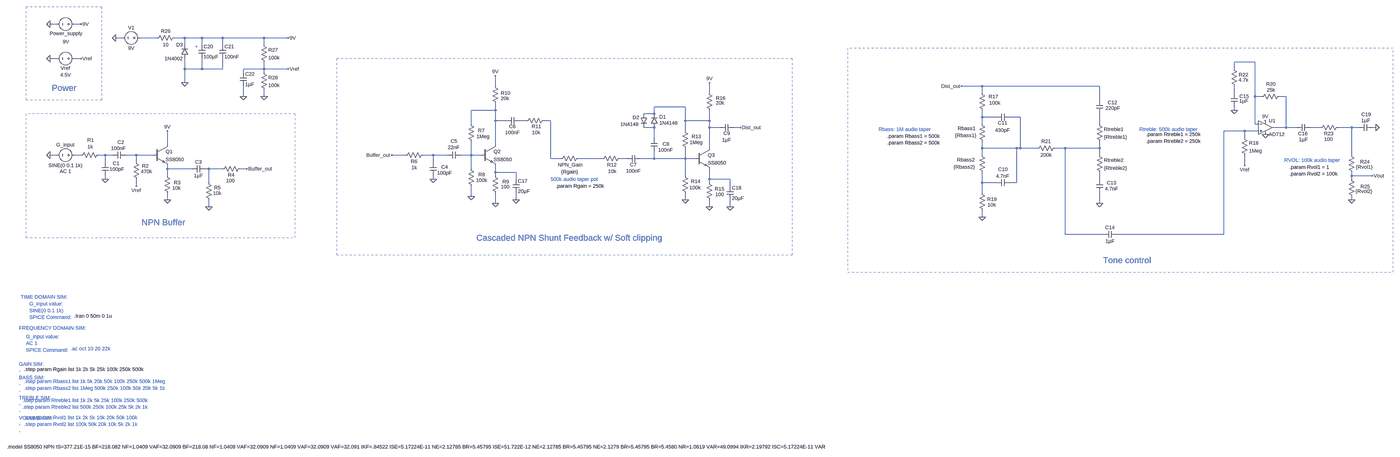
[diagram p0: schematic fuzz_pedal_PowerSup.asc, whole sheet]
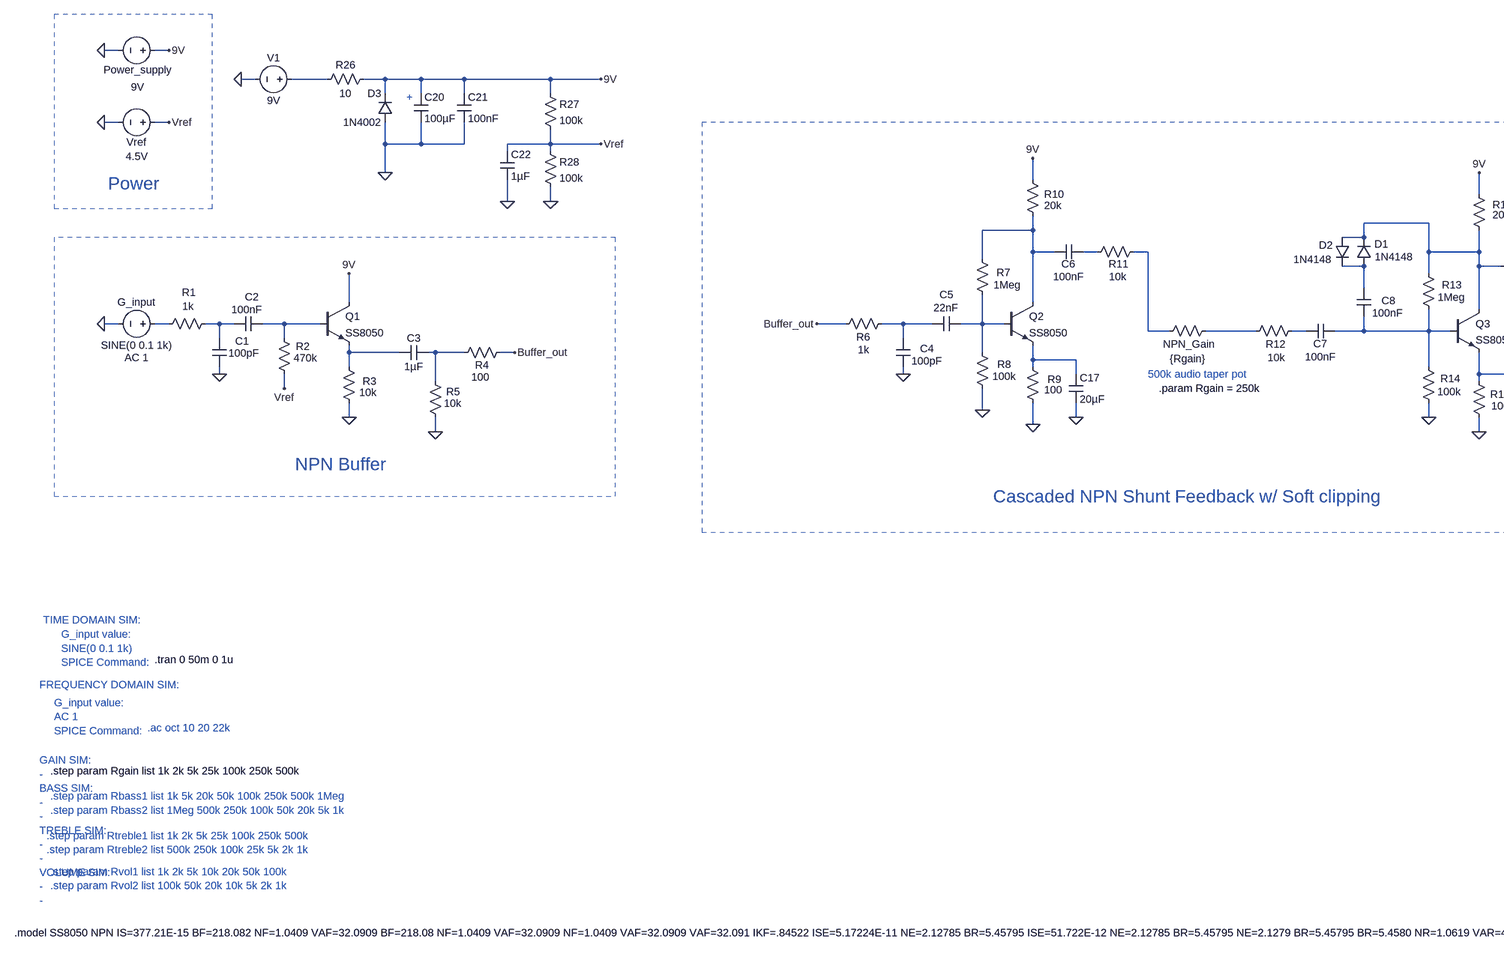
[diagram p1: schematic fuzz_pedal_PowerSup.asc, part, row 1 of 1, column 1 of 2]
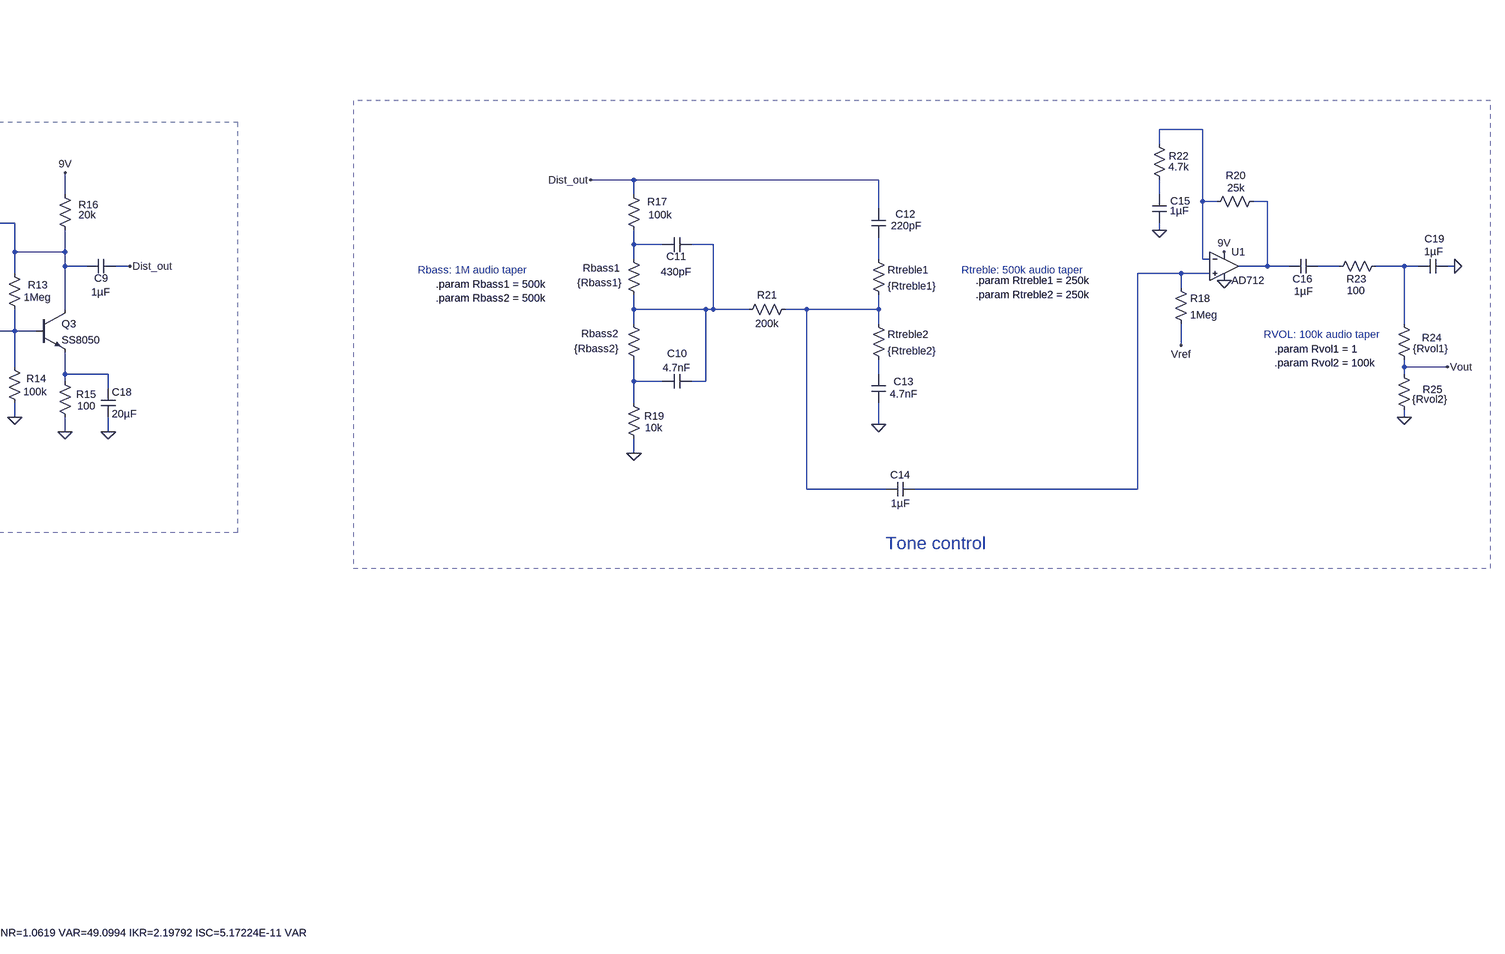
[diagram p2: schematic fuzz_pedal_PowerSup.asc, part, row 1 of 1, column 2 of 2]
fuzz_pedal_PowerSup.asc, the LTspice schematic file:
Version 4
SHEET 1 12484 1584
WIRE 176 -528 144 -528
WIRE 288 -528 256 -528
WIRE 480 -464 448 -464
WIRE 640 -464 560 -464
WIRE 768 -464 720 -464
WIRE 848 -464 768 -464
WIRE 944 -464 848 -464
WIRE 1136 -464 944 -464
WIRE 1248 -464 1136 -464
WIRE 768 -432 768 -464
WIRE 848 -432 848 -464
WIRE 944 -432 944 -464
WIRE 1136 -432 1136 -464
WIRE 176 -368 144 -368
WIRE 288 -368 256 -368
WIRE 5840 -352 5744 -352
WIRE 768 -320 768 -368
WIRE 848 -320 848 -368
WIRE 848 -320 768 -320
WIRE 944 -320 944 -368
WIRE 944 -320 848 -320
WIRE 1136 -320 1136 -352
WIRE 1136 -320 1040 -320
WIRE 1248 -320 1136 -320
WIRE 5744 -320 5744 -352
WIRE 1040 -304 1040 -320
WIRE 1136 -304 1136 -320
WIRE 768 -256 768 -320
WIRE 2208 -240 2208 -288
WIRE 4576 -240 4480 -240
WIRE 5120 -240 4576 -240
WIRE 3200 -208 3200 -256
WIRE 4576 -208 4576 -240
WIRE 5744 -208 5744 -240
WIRE 1040 -192 1040 -240
WIRE 1136 -192 1136 -224
WIRE 5840 -192 5840 -352
WIRE 5872 -192 5840 -192
WIRE 5984 -192 5952 -192
WIRE 5120 -176 5120 -240
WIRE 3088 -144 2944 -144
WIRE 2208 -128 2208 -160
WIRE 2208 -128 2096 -128
WIRE 5744 -128 5744 -144
WIRE 2944 -112 2944 -144
WIRE 2944 -112 2896 -112
WIRE 4576 -96 4576 -128
WIRE 4640 -96 4576 -96
WIRE 4752 -96 4704 -96
WIRE 2208 -80 2208 -128
WIRE 2256 -80 2208 -80
WIRE 2352 -80 2320 -80
WIRE 2464 -80 2432 -80
WIRE 3088 -80 3088 -144
WIRE 3200 -80 3200 -128
WIRE 3200 -80 3088 -80
WIRE 2096 -64 2096 -128
WIRE 4576 -64 4576 -96
WIRE 5120 -64 5120 -112
WIRE 5840 -64 5840 -192
WIRE 5856 -64 5840 -64
WIRE 2944 -48 2896 -48
WIRE 3200 -48 3200 -80
WIRE 3248 -48 3200 -48
WIRE 3344 -48 3312 -48
WIRE 5984 -48 5984 -192
WIRE 5984 -48 5920 -48
WIRE 6032 -48 5984 -48
WIRE 6144 -48 6096 -48
WIRE 6288 -48 6224 -48
WIRE 6320 -48 6288 -48
WIRE 6400 -48 6384 -48
WIRE 3088 -32 3088 -80
WIRE 5792 -32 5696 -32
WIRE 5856 -32 5792 -32
WIRE 2944 0 2944 -48
WIRE 5792 0 5792 -32
WIRE 688 32 688 -32
WIRE 2208 32 2208 -80
WIRE 3200 48 3200 -48
WIRE 4576 48 4576 16
WIRE 4736 48 4576 48
WIRE 4752 48 4752 -96
WIRE 4752 48 4736 48
WIRE 4832 48 4752 48
WIRE 4960 48 4912 48
WIRE 5120 48 5120 16
WIRE 5120 48 4960 48
WIRE 176 80 144 80
WIRE 288 80 256 80
WIRE 400 80 368 80
WIRE 432 80 400 80
WIRE 544 80 496 80
WIRE 624 80 544 80
WIRE 1792 80 1728 80
WIRE 1920 80 1872 80
WIRE 1984 80 1920 80
WIRE 2096 80 2096 16
WIRE 2096 80 2048 80
WIRE 2144 80 2096 80
WIRE 4576 80 4576 48
WIRE 5120 80 5120 48
WIRE 6288 80 6288 -48
WIRE 2464 96 2464 -80
WIRE 2512 96 2464 96
WIRE 2704 96 2592 96
WIRE 2816 96 2784 96
WIRE 2944 96 2944 64
WIRE 2944 96 2880 96
WIRE 3088 96 3088 48
WIRE 3088 96 2944 96
WIRE 3136 96 3088 96
WIRE 400 112 400 80
WIRE 544 112 544 80
WIRE 1920 112 1920 80
WIRE 5792 128 5792 80
WIRE 688 144 688 128
WIRE 800 144 688 144
WIRE 880 144 864 144
WIRE 944 144 880 144
WIRE 1056 144 1024 144
WIRE 2096 144 2096 80
WIRE 2208 160 2208 128
WIRE 2304 160 2208 160
WIRE 688 176 688 144
WIRE 2208 176 2208 160
WIRE 3088 176 3088 96
WIRE 6288 176 6288 160
WIRE 6384 176 6288 176
WIRE 400 192 400 176
WIRE 1920 192 1920 176
WIRE 2304 192 2304 160
WIRE 3200 192 3200 144
WIRE 3296 192 3200 192
WIRE 5120 192 5120 160
WIRE 6288 192 6288 176
WIRE 880 208 880 144
WIRE 3200 208 3200 192
WIRE 4576 208 4576 160
WIRE 4640 208 4576 208
WIRE 4736 208 4736 48
WIRE 4736 208 4704 208
WIRE 544 224 544 192
WIRE 3296 224 3296 192
WIRE 4576 256 4576 208
WIRE 2096 272 2096 224
WIRE 688 288 688 256
WIRE 2304 288 2304 256
WIRE 3088 288 3088 256
WIRE 6288 288 6288 272
WIRE 2208 304 2208 256
WIRE 5120 304 5120 256
WIRE 880 320 880 288
WIRE 3200 320 3200 288
WIRE 3296 320 3296 288
WIRE 4576 368 4576 336
WIRE 4960 448 4960 48
WIRE 5136 448 4960 448
WIRE 5696 448 5696 -32
WIRE 5696 448 5200 448
FLAG 400 192 0
FLAG 144 -528 0
FLAG 288 -528 9V
FLAG 688 -32 9V
FLAG 144 -368 0
FLAG 288 -368 Vref
FLAG 544 224 Vref
FLAG 688 288 0
FLAG 880 320 0
FLAG 1056 144 Buffer_out
FLAG 1728 80 Buffer_out
FLAG 1920 192 0
FLAG 2096 272 0
FLAG 2208 304 0
FLAG 2208 -288 9V
FLAG 3088 288 0
FLAG 3200 320 0
FLAG 3200 -256 9V
FLAG 144 80 0
FLAG 3344 -48 Dist_out
FLAG 4480 -240 Dist_out
FLAG 4576 368 0
FLAG 5120 304 0
FLAG 5792 128 Vref
FLAG 5888 -16 0
FLAG 5888 -80 9V
FLAG 5744 -128 0
FLAG 6384 176 Vout
FLAG 6288 288 0
FLAG 2304 288 0
FLAG 3296 320 0
FLAG 6400 -48 0
FLAG 768 -256 0
FLAG 1040 -192 0
FLAG 1136 -192 0
FLAG 1248 -464 9V
FLAG 1248 -320 Vref
FLAG 448 -464 0
SYMBOL voltage 272 80 R90
WINDOW 0 -32 56 VBottom 2
WINDOW 3 32 56 VTop 2
WINDOW 123 60 56 VTop 2
WINDOW 39 0 0 Left 0
SYMATTR InstName G_input
SYMATTR Value SINE(0 0.1 1k)
SYMATTR Value2 AC 1
SYMBOL res 384 64 R90
WINDOW 0 -38 52 VBottom 2
WINDOW 3 -38 54 VTop 2
SYMATTR InstName R1
SYMATTR Value 1k
SYMBOL cap 384 112 R0
WINDOW 0 51 7 Left 2
WINDOW 3 36 33 Left 2
SYMATTR InstName C1
SYMATTR Value 100pF
SYMBOL cap 496 64 R90
WINDOW 0 -28 24 VBottom 2
WINDOW 3 -31 35 VTop 2
SYMATTR InstName C2
SYMATTR Value 100nF
SYMBOL res 528 96 R0
WINDOW 0 42 34 Left 2
WINDOW 3 37 60 Left 2
SYMATTR InstName R2
SYMATTR Value 470k
SYMBOL npn 624 32 R0
SYMATTR InstName Q1
SYMATTR Value SS8050
SYMBOL voltage 272 -528 R90
WINDOW 0 59 54 VBottom 2
WINDOW 3 66 54 VTop 2
SYMATTR InstName Power_supply
SYMATTR Value 9V
SYMBOL voltage 272 -368 R90
WINDOW 0 60 57 VBottom 2
WINDOW 3 60 56 VTop 2
SYMATTR InstName Vref
SYMATTR Value 4.5V
SYMBOL res 672 160 R0
WINDOW 0 46 48 Left 2
WINDOW 3 39 73 Left 2
SYMATTR InstName R3
SYMATTR Value 10k
SYMBOL res 1040 128 R90
WINDOW 0 60 56 VBottom 2
WINDOW 3 55 60 VTop 2
SYMATTR InstName R4
SYMATTR Value 100
SYMBOL res 864 192 R0
WINDOW 0 40 39 Left 2
WINDOW 3 35 65 Left 2
SYMATTR InstName R5
SYMATTR Value 10k
SYMBOL res 1888 64 R90
WINDOW 0 61 57 VBottom 2
WINDOW 3 58 56 VTop 2
SYMATTR InstName R6
SYMATTR Value 1k
SYMBOL cap 1904 112 R0
WINDOW 0 53 23 Left 2
WINDOW 3 34 51 Left 2
SYMATTR InstName C4
SYMATTR Value 100pF
SYMBOL cap 2048 64 R90
WINDOW 0 -33 32 VBottom 2
WINDOW 3 -35 33 VTop 2
SYMATTR InstName C5
SYMATTR Value 22nF
SYMBOL res 2080 -80 R0
WINDOW 0 47 46 Left 2
WINDOW 3 41 74 Left 2
SYMATTR InstName R7
SYMATTR Value 1Meg
SYMBOL res 2080 128 R0
WINDOW 0 49 42 Left 2
WINDOW 3 38 69 Left 2
SYMATTR InstName R8
SYMATTR Value 100k
SYMBOL npn 2144 32 R0
SYMATTR InstName Q2
SYMATTR Value SS8050
SYMBOL res 2192 160 R0
WINDOW 0 49 44 Left 2
WINDOW 3 41 67 Left 2
SYMATTR InstName R9
SYMATTR Value 100
SYMBOL res 2192 -256 R0
WINDOW 0 41 48 Left 2
WINDOW 3 41 73 Left 2
SYMATTR InstName R10
SYMATTR Value 20k
SYMBOL cap 2320 -96 R90
WINDOW 0 59 33 VBottom 2
WINDOW 3 56 32 VTop 2
SYMATTR InstName C6
SYMATTR Value 100nF
SYMBOL res 2448 -96 R90
WINDOW 0 59 49 VBottom 2
WINDOW 3 56 51 VTop 2
SYMATTR InstName R11
SYMATTR Value 10k
SYMBOL res 2608 80 R90
WINDOW 0 61 53 VBottom 2
WINDOW 3 62 56 VTop 2
SYMATTR InstName NPN_Gain
SYMATTR Value {Rgain}
SYMBOL res 2800 80 R90
WINDOW 0 61 52 VBottom 2
WINDOW 3 60 51 VTop 2
SYMATTR InstName R12
SYMATTR Value 10k
SYMBOL cap 2880 80 R90
WINDOW 0 60 33 VBottom 2
WINDOW 3 58 32 VTop 2
SYMATTR InstName C7
SYMATTR Value 100nF
SYMBOL npn 3136 48 R0
SYMATTR InstName Q3
SYMATTR Value SS8050
SYMBOL cap 2928 0 R0
WINDOW 0 55 29 Left 2
WINDOW 3 34 56 Left 2
SYMATTR InstName C8
SYMATTR Value 100nF
SYMBOL res 3072 -48 R0
WINDOW 0 45 42 Left 2
WINDOW 3 36 69 Left 2
SYMATTR InstName R13
SYMATTR Value 1Meg
SYMBOL res 3072 160 R0
WINDOW 0 42 42 Left 2
WINDOW 3 35 71 Left 2
SYMATTR InstName R14
SYMATTR Value 100k
SYMBOL res 3184 192 R0
WINDOW 0 41 45 Left 2
WINDOW 3 43 71 Left 2
SYMATTR InstName R15
SYMATTR Value 100
SYMBOL diode 2960 -48 R180
WINDOW 0 -38 49 Left 2
WINDOW 3 -93 21 Left 2
SYMATTR InstName D1
SYMATTR Value 1N4148
SYMBOL diode 2880 -112 R0
WINDOW 0 -36 17 Left 2
WINDOW 3 -93 49 Left 2
SYMATTR InstName D2
SYMATTR Value 1N4148
SYMBOL res 3184 -224 R0
WINDOW 0 46 39 Left 2
WINDOW 3 46 62 Left 2
SYMATTR InstName R16
SYMATTR Value 20k
SYMBOL cap 3312 -64 R90
WINDOW 0 58 32 VBottom 2
WINDOW 3 58 33 VTop 2
SYMATTR InstName C9
SYMATTR Value 1µF
SYMBOL cap 864 128 R90
WINDOW 0 0 32 VBottom 2
WINDOW 3 32 32 VTop 2
SYMATTR InstName C3
SYMATTR Value 1µF
SYMBOL res 4560 -224 R0
WINDOW 0 46 33 Left 2
WINDOW 3 48 62 Left 2
SYMATTR InstName R17
SYMATTR Value 100k
SYMBOL res 4560 240 R0
WINDOW 0 39 45 Left 2
WINDOW 3 41 71 Left 2
SYMATTR InstName R19
SYMATTR Value 10k
SYMBOL cap 4704 192 R90
WINDOW 0 -30 32 VBottom 2
WINDOW 3 -30 33 VTop 2
SYMATTR InstName C10
SYMATTR Value 4.7nF
SYMBOL cap 4704 -112 R90
WINDOW 0 58 34 VBottom 2
WINDOW 3 61 34 VTop 2
SYMATTR InstName C11
SYMATTR Value 430pF
SYMBOL res 4560 -80 R0
WINDOW 0 -98 36 Left 2
WINDOW 3 -110 69 Left 2
SYMATTR InstName Rbass1
SYMATTR Value {Rbass1}
SYMBOL res 4560 64 R0
WINDOW 0 -101 38 Left 2
WINDOW 3 -117 71 Left 2
SYMATTR InstName Rbass2
SYMATTR Value {Rbass2}
SYMBOL res 4928 32 R90
WINDOW 0 0 56 VBottom 2
WINDOW 3 32 56 VTop 2
SYMATTR InstName R21
SYMATTR Value 200k
SYMBOL res 5104 -80 R0
SYMATTR InstName Rtreble1
SYMATTR Value {Rtreble1}
SYMBOL res 5104 64 R0
SYMATTR InstName Rtreble2
SYMATTR Value {Rtreble2}
SYMBOL cap 5104 -176 R0
WINDOW 0 53 12 Left 2
WINDOW 3 43 38 Left 2
SYMATTR InstName C12
SYMATTR Value 220pF
SYMBOL cap 5104 192 R0
WINDOW 0 49 17 Left 2
WINDOW 3 41 44 Left 2
SYMATTR InstName C13
SYMATTR Value 4.7nF
SYMBOL cap 5200 432 R90
WINDOW 0 0 32 VBottom 2
WINDOW 3 32 32 VTop 2
SYMATTR InstName C14
SYMATTR Value 1µF
SYMBOL res 5776 -16 R0
SYMATTR InstName R18
SYMATTR Value 1Meg
SYMBOL OpAmps\\AD712 5888 -112 R0
SYMATTR InstName U1
SYMBOL res 5968 -208 R90
WINDOW 0 -26 54 VBottom 2
WINDOW 3 -30 54 VTop 2
SYMATTR InstName R20
SYMATTR Value 25k
SYMBOL res 5728 -336 R0
WINDOW 0 37 43 Left 2
WINDOW 3 36 67 Left 2
SYMATTR InstName R22
SYMATTR Value 4.7k
SYMBOL cap 5728 -208 R0
WINDOW 0 40 15 Left 2
WINDOW 3 39 37 Left 2
SYMATTR InstName C15
SYMATTR Value 1µF
SYMBOL cap 6096 -64 R90
WINDOW 0 60 34 VBottom 2
WINDOW 3 56 32 VTop 2
SYMATTR InstName C16
SYMATTR Value 1µF
SYMBOL res 6240 -64 R90
WINDOW 0 60 58 VBottom 2
WINDOW 3 55 59 VTop 2
SYMATTR InstName R23
SYMATTR Value 100
SYMBOL res 6272 64 R0
WINDOW 0 55 47 Left 2
WINDOW 3 35 71 Left 2
SYMATTR InstName R24
SYMATTR Value {Rvol1}
SYMBOL res 6272 176 R0
WINDOW 0 57 50 Left 2
WINDOW 3 34 72 Left 2
SYMATTR InstName R25
SYMATTR Value {Rvol2}
SYMBOL cap 2288 192 R0
SYMATTR InstName C17
SYMATTR Value 20µF
SYMBOL cap 3280 224 R0
SYMATTR InstName C18
SYMATTR Value 20µF
SYMBOL cap 6384 -64 R90
WINDOW 0 -29 29 VBottom 2
WINDOW 3 -32 31 VTop 2
SYMATTR InstName C19
SYMATTR Value 1µF
SYMBOL res 736 -480 R90
WINDOW 0 0 56 VBottom 2
WINDOW 3 32 56 VTop 2
SYMATTR InstName R26
SYMATTR Value 10
SYMBOL diode 784 -368 R180
WINDOW 0 24 64 Left 2
WINDOW 3 24 0 Left 2
SYMATTR InstName D3
SYMATTR Value 1N4002
SYMBOL cap 928 -432 R0
SYMATTR InstName C21
SYMATTR Value 100nF
SYMBOL cap 832 -432 R0
SYMATTR InstName C20
SYMATTR Value 100µF
SYMBOL res 1120 -448 R0
SYMATTR InstName R27
SYMATTR Value 100k
SYMBOL res 1120 -320 R0
SYMATTR InstName R28
SYMATTR Value 100k
SYMBOL cap 1024 -304 R0
SYMATTR InstName C22
SYMATTR Value 1µF
SYMBOL voltage 576 -464 R90
WINDOW 0 -32 56 VBottom 2
WINDOW 3 32 56 VTop 2
SYMATTR InstName V1
SYMATTR Value 9V
TEXT 568 392 Left 4 ;NPN Buffer
TEXT 152 -232 Left 4 ;Power
TEXT 2464 192 Left 2 ;500k audio taper pot
TEXT 2120 464 Left 4 ;Cascaded NPN Shunt Feedback w/ Soft clipping
TEXT 8 872 Left 2 ;TIME DOMAIN SIM:
TEXT 48 904 Left 2 ;G_input value:\nSINE(0 0.1 1k)\nSPICE Command:
TEXT 0 1016 Left 2 ;FREQUENCY DOMAIN SIM:
TEXT 32 1056 Left 2 ;G_input value:\nAC 1\nSPICE Command:
TEXT 0 1184 Left 2 ;GAIN SIM:\n-\nBASS SIM:\n- \n- \nTREBLE SIM:\n-\n-\nVOLUME SIM:\n-\n-
TEXT -56 1568 Left 2 !.model SS8050 NPN IS=377.21E-15 BF=218.082 NF=1.0409 VAF=32.0909 BF=218.08 NF=1.0409 VAF=32.0909 NF=1.0409 VAF=32.0909 VAF=32.091 IKF=.84522 ISE=5.17224E-11 NE=2.12785 BR=5.45795 ISE=51.722E-12 NE=2.12785 BR=5.45795 NE=2.1279 BR=5.45795 BR=5.4580 NR=1.0619 VAR=49.0994 IKR=2.19792 ISC=5.17224E-11 VAR=49.099 IKR=2.19792 ISC=5.17224E-11 IKR=2.1979 ISC=5.17224E-11 ISC=51.722E-12 NC=3.9685 RB=5.74704 IRB=0.1 RBM=0.1 RE=841.72E-6 RC=0.248242 XTB=0.626944 XTI=1 RB=5.7470 IRB=0.1 RBM=0.1 RC=.24824 XTB=0.626944 XTI=1 CJE=27.335E-12 VJE=0.721406 MJE=0.85 VJE=.72141 MJE=0.85 MJE=.85 CJC=26.000E-12 VJC=0.4 MJC=0.367851 XCJC=0.1 VJC=.4 MJC=0.367851 XCJC=0.1 MJC=.36785 XCJC=0.1 FC=.9999 CJS=0 VJS=0.75 MJS=0.5 TF=643.94E-12 XTF=1.43228 VTF=0.344801 ITF=1.20072 XTF=1.4323 VTF=0.344801 ITF=1.20072 VTF=.3448 ITF=1.20072 ITF=1.2007 TR=100.00E-9 PTF=0 KF=0 AF=1 EG=1.0500 CJE=2.73346E-11 VJE=0.721406 MJE=0.85 XTB=.62694 XTI=1 XTI=1
TEXT 2488 224 Left 2 !.param Rgain = 250k
TEXT 5136 568 Left 4 ;Tone control
TEXT 4096 -40 Left 2 ;Rbass: 1M audio taper
TEXT 5304 -40 Left 2 ;Rtreble: 500k audio taper
TEXT 4136 -8 Left 2 !.param Rbass1 = 500k\n.param Rbass2 = 500k
TEXT 5336 -16 Left 2 !.param Rtreble1 = 250k\n.param Rtreble2 = 250k
TEXT 5976 104 Left 2 ;RVOL: 100k audio taper
TEXT 6000 136 Left 2 !.param Rvol1 = 1\n.param Rvol2 = 100k
TEXT 24 1264 Left 2 ;.step param Rbass1 list 1k 5k 20k 50k 100k 250k 500k 1Meg\n.step param Rbass2 list 1Meg 500k 250k 100k 50k 20k 5k 1k
TEXT 24 1208 Left 2 !.step param Rgain list 1k 2k 5k 25k 100k 250k 500k
TEXT 16 1352 Left 2 ;.step param Rtreble1 list 1k 2k 5k 25k 100k 250k 500k\n.step param Rtreble2 list 500k 250k 100k 25k 5k 2k 1k
TEXT 24 1432 Left 2 ;.step param Rvol1 list 1k 2k 5k 10k 20k 50k 100k\n.step param Rvol2 list 100k 50k 20k 10k 5k 2k 1k
TEXT 256 960 Left 2 !.tran 0 50m 0 1u
TEXT 240 1112 Left 2 ;.ac oct 10 20 22k
TEXT 816 -424 Left 2 ;+
RECTANGLE Normal 1280 -112 32 464 2
RECTANGLE Normal 384 -608 32 -176 2
RECTANGLE Normal 3584 -368 1472 544 2
RECTANGLE Normal 6480 -416 3952 624 2

The netlist it stands for:
* fuzz_pedal_PowerSup.asc
V§G_input N017 0 SINE(0 0.1 1k) AC 1
R1 N018 N017 1k
C1 N018 0 100pF
C2 N019 N018 100nF
R2 N019 Vref 470k
Q1 9V N019 N025 0 SS8050
V§Power_supply 9V 0 9V
Vref Vref 0 4.5V
R3 N025 0 10k
R4 Buffer_out N026 100
R5 N026 0 10k
R6 N020 Buffer_out 1k
C4 N020 0 100pF
C5 N021 N020 22nF
R7 N006 N021 1Meg
R8 N021 0 100k
Q2 N006 N021 N027 0 SS8050
R9 N027 0 100
R10 9V N006 20k
C6 N009 N006 100nF
R11 N010 N009 10k
R§NPN_Gain N022 N010 {Rgain}
R12 N023 N022 10k
C7 N024 N023 100nF
Q3 N005 N024 N028 0 SS8050
C8 N012 N024 100nF
R13 N005 N024 1Meg
R14 N024 0 100k
R15 N028 0 100
D1 N012 N005 1N4148
D2 N005 N012 1N4148
R16 9V N005 20k
C9 Dist_out N005 1µF
C3 N026 N025 1µF
R17 Dist_out N007 100k
R19 N030 0 10k
C10 N008 N030 4.7nF
C11 N008 N007 430pF
Rbass1 N007 N008 {Rbass1}
Rbass2 N008 N030 {Rbass2}
R21 N016 N008 200k
Rtreble1 N011 N016 {Rtreble1}
Rtreble2 N016 N029 {Rtreble2}
C12 Dist_out N011 220pF
C13 N029 0 4.7nF
C14 N015 N016 1µF
R18 N015 Vref 1Meg
XU1 N015 N002 9V 0 N004 AD712  ; pins In+ In- V+ V- OUT
R20 N004 N002 25k
R22 N002 N003 4.7k
C15 N003 0 1µF
C16 N013 N004 1µF
R23 N014 N013 100
R24 N014 Vout {Rvol1}
R25 Vout 0 {Rvol2}
C17 N027 0 20µF
C18 N028 0 20µF
C19 0 N014 1µF
R26 9V N001 10
D3 0 9V 1N4002
C21 9V 0 100nF
C20 9V 0 100µF
R27 9V Vref 100k
R28 Vref 0 100k
C22 Vref 0 1µF
V1 N001 0 9V
.model D D
.lib standard.dio
.model NPN NPN
.model PNP PNP
.lib standard.bjt
* NPN Buffer
* Power
* 500k audio taper pot
* Cascaded NPN Shunt Feedback w/ Soft clipping
* TIME DOMAIN SIM:
* G_input value:
* SINE(0 0.1 1k)
* SPICE Command:
* FREQUENCY DOMAIN SIM:
* G_input value:
* AC 1
* SPICE Command:
* GAIN SIM:
* -
* BASS SIM:
* -
* -
* TREBLE SIM:
* -
* -
* VOLUME SIM:
* -
* -
.model SS8050 NPN IS=377.21E-15 BF=218.082 NF=1.0409 VAF=32.0909 BF=218.08 NF=1.0409 VAF=32.0909 NF=1.0409 VAF=32.0909 VAF=32.091 IKF=.84522 ISE=5.17224E-11 NE=2.12785 BR=5.45795 ISE=51.722E-12 NE=2.12785 BR=5.45795 NE=2.1279 BR=5.45795 BR=5.4580 NR=1.0619 VAR=49.0994 IKR=2.19792 ISC=5.17224E-11 VAR=49.099 IKR=2.19792 ISC=5.17224E-11 IKR=2.1979 ISC=5.17224E-11 ISC=51.722E-12 NC=3.9685 RB=5.74704 IRB=0.1 RBM=0.1 RE=841.72E-6 RC=0.248242 XTB=0.626944 XTI=1 RB=5.7470 IRB=0.1 RBM=0.1 RC=.24824 XTB=0.626944 XTI=1 CJE=27.335E-12 VJE=0.721406 MJE=0.85 VJE=.72141 MJE=0.85 MJE=.85 CJC=26.000E-12 VJC=0.4 MJC=0.367851 XCJC=0.1 VJC=.4 MJC=0.367851 XCJC=0.1 MJC=.36785 XCJC=0.1 FC=.9999 CJS=0 VJS=0.75 MJS=0.5 TF=643.94E-12 XTF=1.43228 VTF=0.344801 ITF=1.20072 XTF=1.4323 VTF=0.344801 ITF=1.20072 VTF=.3448 ITF=1.20072 ITF=1.2007 TR=100.00E-9 PTF=0 KF=0 AF=1 EG=1.0500 CJE=2.73346E-11 VJE=0.721406 MJE=0.85 XTB=.62694 XTI=1 XTI=1
.param Rgain = 250k
* Tone control
* Rbass: 1M audio taper
* Rtreble: 500k audio taper
.param Rbass1 = 500k
.param Rbass2 = 500k
.param Rtreble1 = 250k
.param Rtreble2 = 250k
* RVOL: 100k audio taper
.param Rvol1 = 1
.param Rvol2 = 100k
* .step param Rbass1 list 1k 5k 20k 50k 100k 250k 500k 1Meg
* .step param Rbass2 list 1Meg 500k 250k 100k 50k 20k 5k 1k
.step param Rgain list 1k 2k 5k 25k 100k 250k 500k
* .step param Rtreble1 list 1k 2k 5k 25k 100k 250k 500k
* .step param Rtreble2 list 500k 250k 100k 25k 5k 2k 1k
* .step param Rvol1 list 1k 2k 5k 10k 20k 50k 100k
* .step param Rvol2 list 100k 50k 20k 10k 5k 2k 1k
.tran 0 50m 0 1u
* .ac oct 10 20 22k
* +
.backanno
.end